# Altium schematic sheet TRACTIAN_Wireless.SchDoc
size A
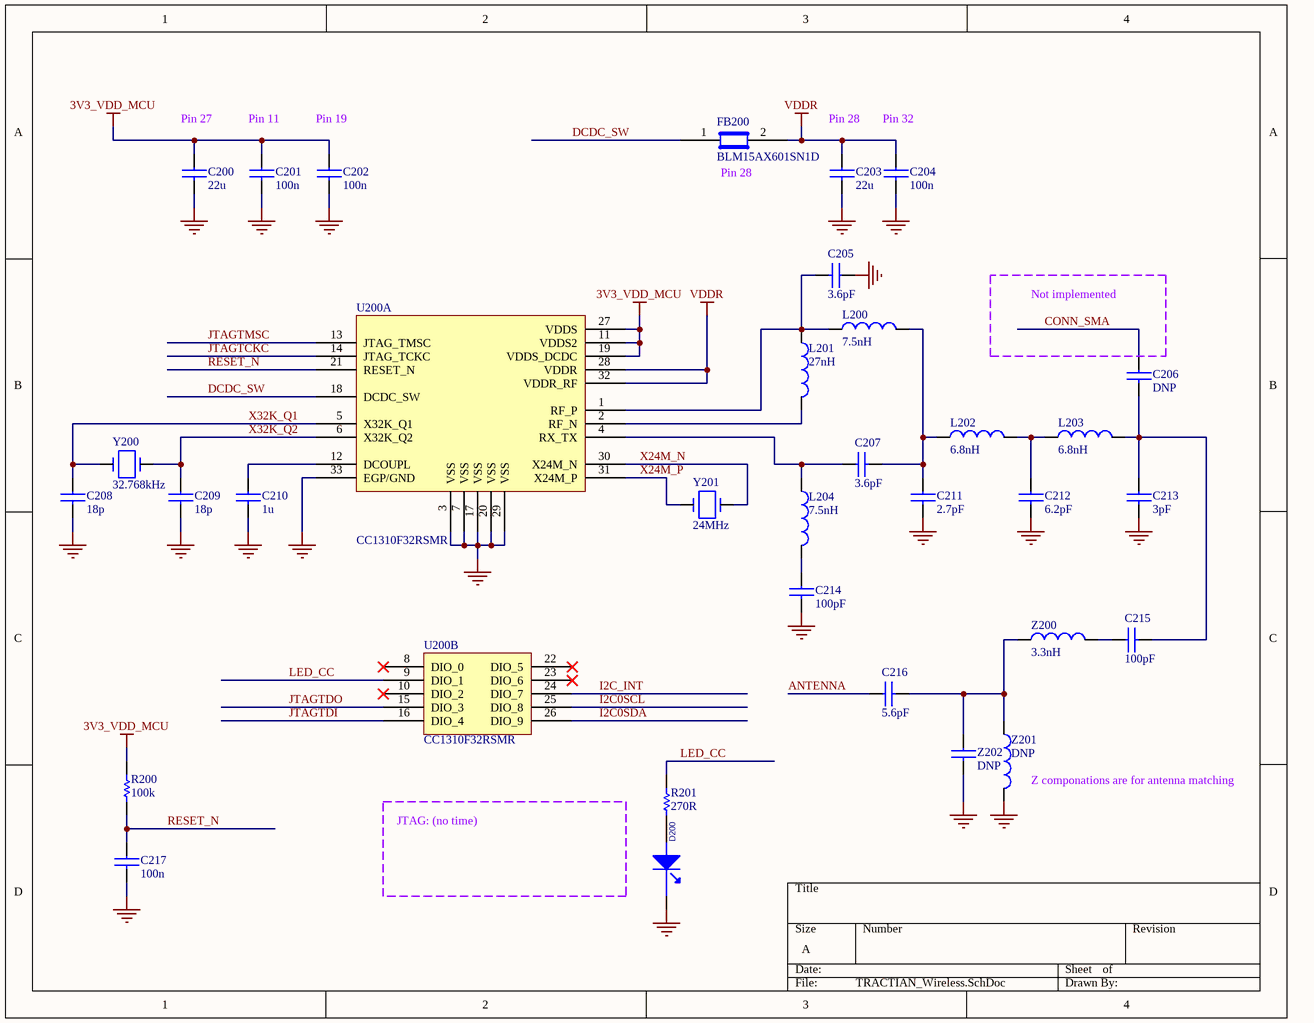
[diagram p0: TRACTIAN_Wireless.SchDoc]

## Parts
C200  22u  [C0805]
C201  100n  [C0402]
C202  100n  [C0402]
C203  22u  [C0805]
C204  100n  [C0402]
C205  3.6pF  [C0402]
C206  DNP  [C0402]
C207  3.6pF  [C0402]
C208  18p  [C0402]
C209  18p  [C0402]
C210  1u  [C0402]
C211  2.7pF  [C0402]
C212  6.2pF  [C0402]
C213  3pF  [C0402]
C214  100pF  [C0402]
C215  100pF  [C0402]
C216  5.6pF  [C0402]
C217  100n  [C0402]
D200  (no value)  [LED_0603]
FB200  BLM15AX601SN1D  [C0402]
L200  7.5nH  [L0402]
L201  27nH  [L0402]
L202  6.8nH  [L0402]
L203  6.8nH  [L0402]
L204  7.5nH  [L0402]
R200  100k  [R0402]
R201  270R  [R0402]
U200  CC1310F32RSMR  [VQFN-32]  (parts A,B of 2)
Y200  32.768kHz  [ABS06]
Y201  24MHz  [ABS06]
Z200  3.3nH  [L0402]
Z201  DNP  [L0402]
Z202  DNP  [C0402]

## Nets
3V3_VDD_MCU: C200.1 C201.1 C202.1 R200.2 U200.11(VDDS2) U200.19(VDDS_DCDC) U200.27(VDDS)
GND: C200.2 C201.2 C202.2 C203.2 C204.2 C205.1 C208.2 C209.2 C210.2 C211.2 C212.2 C213.2 C214.2 C217.2 D200.1(cathode) U200.3(VSS) U200.7(VSS) U200.17(VSS) U200.20(VSS) U200.29(VSS) U200.33(EGP/GND) Z201.2 Z202.2
VDDR: C203.1 C204.1 FB200.2 U200.28(VDDR) U200.32(VDDR_RF)
ANTENNA: C216.1
CONN_SMA: C206.1
DCDC_SW: FB200.1 U200.18(DCDC_SW)
I2C0SCL: U200.25(DIO_8)
I2C0SDA: U200.26(DIO_9)
I2C_INT: U200.24(DIO_7)
JTAGTCKC: U200.14(JTAG_TCKC)
JTAGTDI: U200.16(DIO_4)
JTAGTDO: U200.15(DIO_3)
JTAGTMSC: U200.13(JTAG_TMSC)
LED_CC: R201.2 U200.9(DIO_1)
RESET_N: C217.1 R200.1 U200.21(RESET_N)
X24M_N: U200.30(X24M_N) Y201.2
X24M_P: U200.31(X24M_P) Y201.1
X32K_Q1: C208.1 U200.5(X32K_Q1) Y200.1
X32K_Q2: C209.1 U200.6(X32K_Q2) Y200.2
NetC205_2: C205.2 L200.1 L201.1 U200.1(RF_P)
NetC206_2: C206.2 C213.1 C215.2 L203.2
NetC207_1: C207.1 L204.1 U200.4(RX_TX)
NetC207_2: C207.2 C211.1 L200.2 L202.1
NetC210_1: C210.1 U200.12(DCOUPL)
NetC212_1: C212.1 L202.2 L203.1
NetC214_1: C214.1 L204.2
NetC215_1: C215.1 Z200.2
NetC216_2: C216.2 Z200.1 Z201.1 Z202.1
NetD200_2: D200.2(ANODE) R201.1
NetL201_2: L201.2 U200.2(RF_N)

Not connected (* = marked no-connect by the designer): U200 8(DIO_0)* 10(DIO_2)* 22(DIO_5)* 23(DIO_6)*

## Notes on the sheet
- Pin 27
- Pin 11
- (near C202) Pin 19
- Pin 28
- Pin 32
- (near FB200) Pin 28
- Not implemented
- JTAG: (no time)
- (near Z201) Z componations are for antenna matching

## Library data of the parts
C200 C203 = C2012X5R1C226K: CAP CER 22UF 16V 10% X5R 0805; Manufacturer: TDK Corporation; Capacitance: 22µF; .Checked PCB: RF; Supplier 1: Digi-Key; Supplier Part Number 1: 445-6797-1-ND; Manufacturer Part Number: C2012X5R1C226K; RoHS: RoHS Compliant; Category: Capacitors; Stock 1: 15408; Pricing 1: 1=0.77, 10=0.737, 100=0.3575, 250=0.297, 500=0.2695, 1000=0.2475 (USD); Voltage - Rated: 16V; Tolerance: ±10%; Temperature Coefficient: X5R; Mounting Type: Surface Mount, MLCC; Operating Temperature: -55°C ~ 85°C; Applications: General Purpose; Ratings: -; Package / Case: 0805 (2012 Metric); Size / Dimension: 0.079" L x 0.049" W (2.00mm x 1.25mm); Height - Seated (Max): -; Thickness (Max): 0.057" (1.45mm); Lead Spacing: -; Features: -; Packaging: Cut Tape (CT); Lead Style: -; ComponentLink1URL: http://www.tdk.com/pdf/general_B11.pdf; ComponentLink1Description: http://www.tdk.com/pdf/general_B11.pdf; .Checked SCH: RF
C201 C202 C204 C217 = C1005X5R1H104K: CAP CER .10UF 50V X5R 10% 0402; Manufacturer: TDK Corporation; Capacitance: 0.1µF; Value: 100nF; .Checked PCB: used; Category: Capacitors; Supplier Part Number: 445-5942-1-ND; Manufacturer Part Number: C1005X5R1H104K; Operating Temperature: -55°C ~ 85°C; Package / Case: 0402 (1005 Metric); Price 1k [$]: 0.02340; .Checked SCH: used; Voltage - Rated: 50V; Supplier: Digikey; Supplier 1: Digi-Key; Supplier Part Number 1: 445-5942-1-ND; RoHS: RoHS Compliant; Stock 1: 106926; Pricing 1: 1=0.27, 10=0.18, 100=0.072, 250=0.05176, 500=0.0369, 1000=0.027 (USD); Tolerance: ±10%; Temperature Coefficient: X5R; Mounting Type: Surface Mount, MLCC; Applications: General Purpose; Ratings: -; Size / Dimension: 0.039" L x 0.020" W (1.00mm x 0.50mm); Height - Seated (Max): -; Thickness (Max): 0.022" (0.55mm); Lead Spacing: -; Features: -; Packaging: Cut Tape (CT); Lead Style: -; ComponentLink1URL: http://www.tdk.co.jp/tefe02/e412_c.pdf; ComponentLink1Description: http://www.tdk.co.jp/tefe02/e412_c.pdf
C205-C207 C211-C216 Z202 = Cap: CAPACITOR; ComponentLink1URL: http://www.vishay.com/doc?34104; ComponentLink1Description: http://www.vishay.com/doc?34104
  C205 C207: Value: 3.6pF
  C206 Z202: Value: DNP
  C211: Value: 2.7pF
  C212: Value: 6.2pF
  C213: Value: 3pF
  C214 C215: Value: 100pF
  C216: Value: 5.6pF
C208 C209 = C1005C0G1H180J: CAP CER 18PF 50V C0G 5% 0402; Manufacturer: TDK Corporation; .Checked PCB: used; Temperature Coefficient: C0G, NP0; Capacitance: 18pF; Category: Capacitors; Supplier Part Number: 445-1238-1-ND; Manufacturer Part Number: C1005C0G1H180J; Operating Temperature: -55°C ~ 125°C; Package / Case: 0402 (1005 Metric); Price 1k [$]: 0.00468; Value: 18pF; .Checked SCH: used; Voltage - Rated: 50V; Supplier: Digikey; Supplier 1: Digi-Key; Supplier Part Number 1: 445-1238-1-ND; RoHS: RoHS Compliant; Stock 1: 24321; Pricing 1: 1=0.08, 10=0.05, 100=0.018, 250=0.013, 500=0.0096, 1000=0.0065 (USD); Tolerance: ±5%; Mounting Type: Surface Mount, MLCC; Applications: General Purpose; Ratings: -; Size / Dimension: 0.039" L x 0.020" W (1.00mm x 0.50mm); Height - Seated (Max): -; Thickness (Max): 0.022" (0.55mm); Lead Spacing: -; Features: -; Packaging: Cut Tape (CT); Lead Style: -; ComponentLink1URL: http://www.tdk.co.jp/tefe02/e412_c.pdf; ComponentLink1Description: http://www.tdk.co.jp/tefe02/e412_c.pdf
C210 = C1005X5R1C105K: CAP CER 1.0UF 16V X5R 0402; Manufacturer: TDK Corporation; Capacitance: 1.0µF; Value: 1uF; .Checked PCB: used; Tolerance: ±10%; Category: Capacitors; Manufacturer Part Number: C1005X5R1C105K; Operating Temperature: -55°C ~ 85°C; Package / Case: 0402 (1005 Metric); Price 1k [$]: 0.02080; .Checked SCH: used; Voltage - Rated: 16V; Supplier Part Number: 445-4978-1-ND; Supplier: Digikey; Supplier 1: Digi-Key; Supplier Part Number 1: 445-4978-1-ND; RoHS: RoHS Compliant; Stock 1: 341010; Pricing 1: 1=0.24, 10=0.16, 100=0.064, 250=0.046, 500=0.0328, 1000=0.024 (USD); Temperature Coefficient: X5R; Mounting Type: Surface Mount, MLCC; Applications: General Purpose; Ratings: -; Size / Dimension: 0.039" L x 0.020" W (1.00mm x 0.50mm); Height - Seated (Max): -; Thickness (Max): 0.022" (0.55mm); Lead Spacing: -; Features: -; Packaging: Cut Tape (CT); Lead Style: -; ComponentLink1URL: http://www.tdk.co.jp/tefe02/e412_c.pdf; ComponentLink1Description: http://www.tdk.co.jp/tefe02/e412_c.pdf
D200 = LED: Generic LED 0603
FB200 = BLM15AX601SN1D: FERRITE CHIP 600 OHM 0402 420mA; Manufacturer: Murata Electronics North America; .Checked PCB: used; Impedance @ Frequency: 600 Ohm @ 100MHz; DC Resistance (DCR): 340 mOhm Max; Filter Type: Differential Mode - Single; Number of Lines: 1; .Checked SCH: used; Category: Filters; Supplier Part Number: 490-5441-1-ND; Manufacturer Part Number: BLM15AX601SN1D; Package / Case: 0402 (1005 Metric); Price 1k [$]: 0.03280; Value: BLM15AX601SN1D; Current Rating: 420mA; Supplier: Digikey; Supplier 1: Digi-Key; Supplier Part Number 1: 490-5441-1-ND; RoHS: RoHS Compliant; Stock 1: 34008; Pricing 1: 1=0.26, 10=0.197, 50=0.1148, 100=0.0918, 250=0.0656, 500=0.0446, 1000=0.03608, 5000=0.02821 (USD); Mounting Type: Surface Mount; Packaging: Cut Tape (CT); Height (Max): 0.022" (0.55mm); Size / Dimension: 0.039" L x 0.020" W (1.00mm x 0.50mm); ComponentLink1URL: http://search.murata.co.jp/Ceramy/image/img/PDF/ENG/L0110S0100BLM15AX_SN.pdf; ComponentLink1Description: http://search.murata.co.jp/Ceramy/image/img/PDF/ENG/L0110S0100BLM15AX_SN.pdf
L200-L204 Z200 Z201 = Ind: INDUCTOR; ComponentLink1URL: http://www.vishay.com/doc?34104; ComponentLink1Description: http://www.vishay.com/doc?34104
  L200 L204: Value: 7.5nH
  L201: Value: 27nH
  L202 L203: Value: 6.8nH
  Z200: Value: 3.3nH
  Z201: Value: DNP
R200 = RMCF0402FT100K: RES 100K OHM 1/16W 1% 0402 SMD; Manufacturer: Stackpole Electronics Inc; Power (Watts): 0.063W, 1/16W; .Checked PCB: used; Temperature Coefficient: ±100ppm/°C; Category: Resistors; Supplier Part Number: RMCF0402FT100KCT-ND; Manufacturer Part Number: RMCF0402FT100K; Package / Case: 0402 (1005 Metric); Price 1k [$]: 0.00384; Resistance (Ohms): 100K; Tolerance: ±1%; Value: 100k; .Checked SCH: used; Supplier: Digikey; Supplier 1: Digi-Key; Supplier Part Number 1: RMCF0402FT100KCT-ND; RoHS: RoHS Compliant; Stock 1: 95; Pricing 1: 1=0.04, 10=0.025, 50=0.0138, 100=0.0105, 250=0.0078, 500=0.00576, 1000=0.00384 (USD); Composition: Thick Film; Features: -; Size / Dimension: 0.039" L x 0.020" W (1.00mm x 0.50mm); Height: 0.016" (0.40mm); Number of Terminations: 2; Packaging: Cut Tape (CT); ComponentLink1URL: http://www.seielect.com/Catalog/SEI-RMCF.pdf; ComponentLink1Description: http://www.seielect.com/Catalog/SEI-RMCF.pdf
R201 = Res: Generic resistor; Value: 270R
U200 = CC1310F32RSMR: CC1310 SimpleLink™ Ultra-Low-Power Sub-1 GHz Wireless MCU; Manufacturer Name: Texas Instruments; PN: CC1310F32RGZR; Digikey PN: 296-50997-1-ND; Mouser PN: 595-CC1310F32RGZR
Y200 = ABS06-32.768KHZ-9-1-T: CRYSTAL 32.768 KHZ 9.0 PF SMD; Manufacturer: Abracon Corporation; .Checked PCB: used; Frequency Stability: ±10ppm; Load Capacitance: 9pF; Operating Mode: Fundamental; .Checked SCH: used; Category: Crystals and Oscillators; Supplier Part Number: 535-10247-1-ND; Manufacturer Part Number: ABS06-32.768KHZ-9-1-T; Operating Temperature: -40°C ~ 85°C; Package / Case: 2-SMD, No Lead (DFN, LCC); Price 1k [$]: 1.24500; Value: 32.768kHz; Frequency: 32.768kHz; Supplier: Digikey; Supplier 1: Digi-Key; Supplier Part Number 1: 535-10247-1-ND; RoHS: RoHS Compliant; Stock 1: 5693; Pricing 1: 1=2.81, 10=2.438, 50=2.1376, 100=1.6875, 500=1.425 (USD); Type: kHz Crystal (Tuning Fork); Frequency Tolerance: ±10ppm; Mounting Type: Surface Mount; Size / Dimension: 0.079" L x 0.047" W (2.00mm x 1.20mm); Height: 0.024" (0.60mm); Packaging: Cut Tape (CT); ComponentLink1URL: http://www.abracon.com/Resonators/ABS06.pdf; ComponentLink1Description: http://www.abracon.com/Resonators/ABS06.pdf
Y201 = ABM7-24.000MHZ-D-2-Y-T: CRYSTAL 24.0000MHZ 18PF SMD; Manufacturer: Abracon Corporation; Frequency Stability: ±30ppm; Frequency Tolerance: ±20ppm; ESR (Equivalent Series Resistance): 50 Ohm; Operating Mode: Fundamental; .Creator: MM; .Checked PCB: RF, used by MM; .Checked SCH: MM, checked by RF; Supplier 1: Digi-Key; Manufacturer Part Number: ABM7-24.000MHZ-D-2-Y-T; RoHS: RoHS Compliant; Category: Crystals and Oscillators; Stock 1: 53059; Pricing 1: 1=1.31, 10=1.138, 50=0.9976, 100=0.7875, 500=0.665 (USD); Type: MHz Crystal; Frequency: 24MHz; Load Capacitance: 18pF; Operating Temperature: -40°C ~ 85°C; Ratings: -; Mounting Type: Surface Mount; Package / Case: 2-SMD; Size / Dimension: 0.236" L x 0.138" W (6.00mm x 3.50mm); Height: 0.055" (1.40mm); Packaging: Cut Tape (CT); ComponentLink1URL: http://www.abracon.com/Resonators/abm7.pdf; ComponentLink1Description: http://www.abracon.com/Resonators/abm7.pdf; Supplier Part Number 1: 535-9845-1-ND